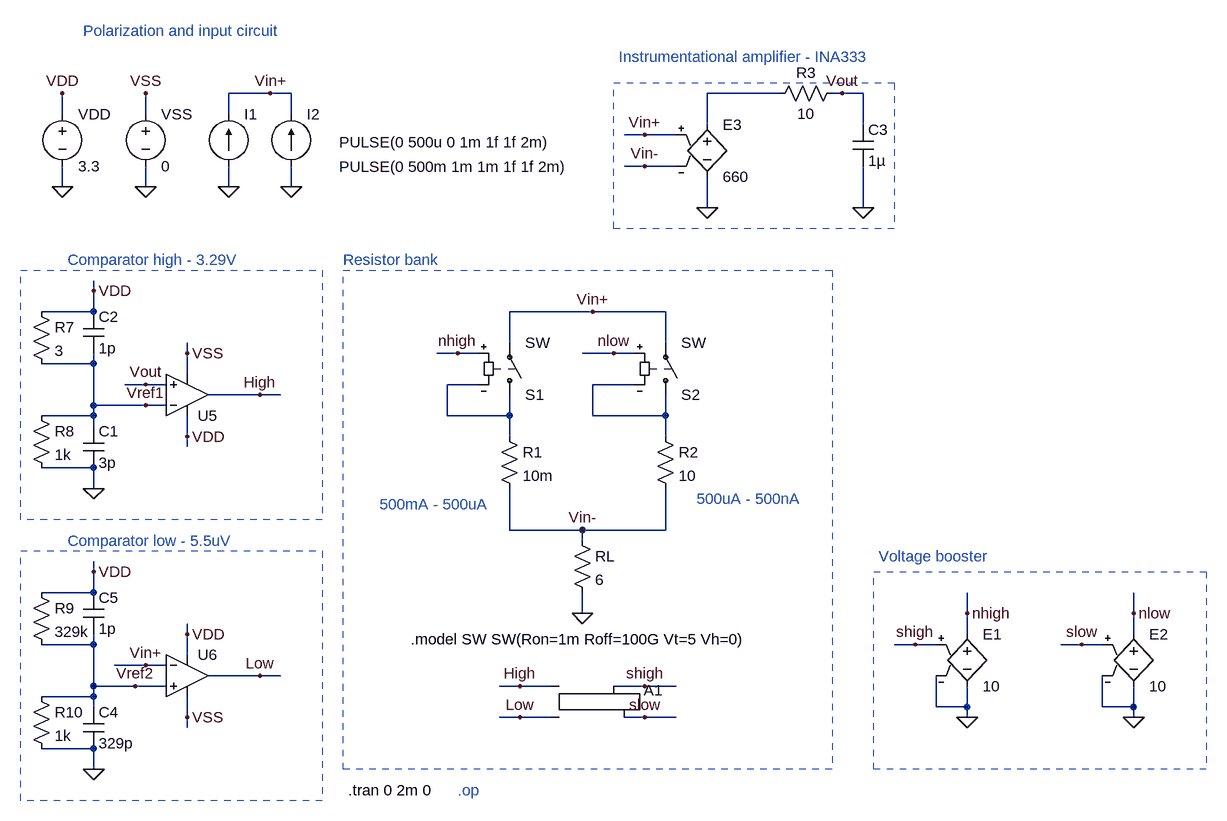
[diagram p0: schematic Top_SCM.asc]
Top_SCM.asc, the LTspice schematic file:
Version 4
SHEET 1 1504 1436
WIRE -832 128 -896 128
WIRE -800 128 -832 128
WIRE -48 128 -160 128
WIRE 48 128 32 128
WIRE 80 128 48 128
WIRE -1152 160 -1152 128
WIRE -1024 160 -1024 128
WIRE -896 160 -896 128
WIRE -800 160 -800 128
WIRE -160 176 -160 128
WIRE 80 176 80 128
WIRE -256 192 -288 192
WIRE -208 192 -256 192
WIRE -256 240 -288 240
WIRE -208 240 -256 240
WIRE -1152 272 -1152 240
WIRE -1024 272 -1024 240
WIRE -896 272 -896 240
WIRE -800 272 -800 240
WIRE -160 304 -160 256
WIRE 80 304 80 240
WIRE -1104 432 -1104 416
WIRE -1104 464 -1104 432
WIRE -1104 464 -1184 464
WIRE -336 464 -464 464
WIRE -224 464 -336 464
WIRE -464 512 -464 464
WIRE -224 512 -224 464
WIRE -960 528 -960 512
WIRE -544 528 -576 528
WIRE -512 528 -544 528
WIRE -304 528 -352 528
WIRE -272 528 -304 528
WIRE -1104 544 -1104 528
WIRE -1104 544 -1184 544
WIRE -960 560 -960 528
WIRE -1024 576 -1056 576
WIRE -992 576 -1024 576
WIRE -512 576 -560 576
WIRE -272 576 -336 576
WIRE -848 592 -928 592
WIRE -816 592 -848 592
WIRE -1104 608 -1104 544
WIRE -1024 608 -1104 608
WIRE -992 608 -1024 608
WIRE -1104 624 -1104 608
WIRE -1104 624 -1184 624
WIRE -560 624 -560 576
WIRE -464 624 -464 592
WIRE -464 624 -560 624
WIRE -336 624 -336 576
WIRE -224 624 -224 592
WIRE -224 624 -336 624
WIRE -1104 640 -1104 624
WIRE -960 656 -960 624
WIRE -464 656 -464 624
WIRE -224 656 -224 624
WIRE -960 672 -960 656
WIRE -1104 704 -1184 704
WIRE -1104 736 -1104 704
WIRE -464 800 -464 736
WIRE -352 800 -464 800
WIRE -224 800 -224 736
WIRE -224 800 -352 800
WIRE -352 816 -352 800
WIRE -1104 864 -1104 848
WIRE -1104 896 -1104 864
WIRE -1104 896 -1184 896
WIRE -352 928 -352 896
WIRE 240 928 240 896
WIRE 496 928 496 896
WIRE -960 960 -960 944
WIRE 240 960 240 928
WIRE 496 960 496 928
WIRE -1104 976 -1104 960
WIRE -1104 976 -1184 976
WIRE 160 976 128 976
WIRE 192 976 160 976
WIRE 416 976 384 976
WIRE 448 976 416 976
WIRE -960 992 -960 960
WIRE -1024 1008 -1072 1008
WIRE -992 1008 -1024 1008
WIRE -848 1024 -928 1024
WIRE -816 1024 -848 1024
WIRE -1104 1040 -1104 976
WIRE -1040 1040 -1104 1040
WIRE -992 1040 -1040 1040
WIRE -448 1040 -480 1040
WIRE -400 1040 -448 1040
WIRE -256 1040 -304 1040
WIRE -208 1040 -256 1040
WIRE -1104 1056 -1104 1040
WIRE -1104 1056 -1184 1056
WIRE -1104 1072 -1104 1056
WIRE 192 1072 192 1024
WIRE 240 1072 240 1040
WIRE 240 1072 192 1072
WIRE 448 1072 448 1024
WIRE 496 1072 496 1040
WIRE 496 1072 448 1072
WIRE -960 1088 -960 1056
WIRE -448 1088 -480 1088
WIRE -400 1088 -448 1088
WIRE -256 1088 -288 1088
WIRE -208 1088 -256 1088
WIRE 240 1088 240 1072
WIRE 496 1088 496 1072
WIRE -960 1104 -960 1088
WIRE -1104 1136 -1184 1136
WIRE -1104 1168 -1104 1136
FLAG -896 272 0
FLAG -832 128 Vin+
FLAG -1152 272 0
FLAG -1024 272 0
FLAG -1024 128 VSS
FLAG -1152 128 VDD
FLAG -960 528 VSS
FLAG -960 656 VDD
FLAG -1104 736 0
FLAG -1104 432 VDD
FLAG -848 592 High
FLAG -960 1088 VSS
FLAG -960 960 VDD
FLAG -1104 1168 0
FLAG -1104 864 VDD
FLAG -848 1024 Low
FLAG -800 272 0
FLAG -352 928 0
FLAG -352 800 Vin-
FLAG -336 464 Vin+
FLAG -448 1088 Low
FLAG -448 1040 High
FLAG -256 1040 shigh
FLAG -256 1088 slow
FLAG -544 528 nhigh
FLAG -304 528 nlow
FLAG 240 1088 0
FLAG 160 976 shigh
FLAG 240 928 nhigh
FLAG 496 1088 0
FLAG 416 976 slow
FLAG 496 928 nlow
FLAG -1024 576 Vout
FLAG -1024 608 Vref1
FLAG -1040 1040 Vref2
FLAG -1024 1008 Vin+
FLAG -160 304 0
FLAG -256 192 Vin+
FLAG -256 240 Vin-
FLAG 80 304 0
FLAG 48 128 Vout
SYMBOL current -896 240 M180
WINDOW 0 24 80 Left 2
WINDOW 3 170 37 Left 2
WINDOW 123 0 0 Left 0
WINDOW 39 0 0 Left 0
SYMATTR InstName I1
SYMATTR Value PULSE(0 500u 0 1m 1f 1f 2m)
SYMBOL voltage -1152 144 R0
WINDOW 123 0 0 Left 0
WINDOW 39 0 0 Left 0
SYMATTR InstName VDD
SYMATTR Value 3.3
SYMBOL voltage -1024 144 R0
WINDOW 123 0 0 Left 0
WINDOW 39 0 0 Left 0
SYMATTR InstName VSS
SYMATTR Value 0
SYMBOL res -480 640 R0
SYMATTR InstName R1
SYMATTR Value 10m
SYMBOL res -240 640 R0
SYMATTR InstName R2
SYMATTR Value 10
SYMBOL OpAmps\\UniversalOpAmp2 -960 592 M180
SYMATTR InstName U5
SYMBOL cap -1120 640 R0
SYMATTR InstName C1
SYMATTR Value 3p
SYMBOL cap -1120 464 R0
SYMATTR InstName C2
SYMATTR Value 1p
SYMBOL res -1200 448 R0
SYMATTR InstName R7
SYMATTR Value 3
SYMBOL res -1200 608 R0
SYMATTR InstName R8
SYMATTR Value 1k
SYMBOL OpAmps\\UniversalOpAmp2 -960 1024 R0
SYMATTR InstName U6
SYMBOL cap -1120 1072 R0
SYMATTR InstName C4
SYMATTR Value 329p
SYMBOL cap -1120 896 R0
SYMATTR InstName C5
SYMATTR Value 1p
SYMBOL res -1200 880 R0
SYMATTR InstName R9
SYMATTR Value 329k
SYMBOL res -1200 1040 R0
SYMATTR InstName R10
SYMATTR Value 1k
SYMBOL current -800 240 M180
WINDOW 0 24 80 Left 2
WINDOW 3 74 -1 Left 2
WINDOW 123 0 0 Left 0
WINDOW 39 0 0 Left 0
SYMATTR InstName I2
SYMATTR Value PULSE(0 500m 1m 1m 1f 1f 2m)
SYMBOL Digital\\srflop -352 992 R0
SYMATTR InstName A1
SYMBOL res -368 800 R0
SYMATTR InstName RL
SYMATTR Value 6
SYMBOL e 240 944 R0
SYMATTR InstName E1
SYMATTR Value 10
SYMBOL e 496 944 R0
SYMATTR InstName E2
SYMATTR Value 10
SYMBOL sw -464 608 M180
SYMATTR InstName S1
SYMBOL sw -224 608 M180
SYMATTR InstName S2
SYMBOL e -160 160 R0
SYMATTR InstName E3
SYMATTR Value 660
SYMBOL res 48 112 R90
WINDOW 0 0 56 VBottom 2
WINDOW 3 32 56 VTop 2
SYMATTR InstName R3
SYMATTR Value 10
SYMBOL cap 64 176 R0
SYMATTR InstName C3
SYMATTR Value 1µ
TEXT -296 72 Left 2 ;Instrumentational amplifier - INA333
TEXT -1120 32 Left 2 ;Polarization and input circuit
TEXT -720 384 Left 2 ;Resistor bank
TEXT -544 1200 Left 2 ;.op
TEXT -712 1200 Left 2 !.tran 0 2m 0
TEXT -1144 384 Left 2 ;Comparator high - 3.29V
TEXT -1144 816 Left 2 ;Comparator low - 5.5uV
TEXT -176 752 Left 2 ;500uA - 500nA
TEXT -664 760 Left 2 ;500mA - 500uA
TEXT -616 968 Left 2 !.model SW SW(Ron=1m Roff=100G Vt=5 Vh=0)
TEXT 104 840 Left 2 ;Voltage booster
RECTANGLE Normal -752 784 -1216 400 2
RECTANGLE Normal -752 1216 -1216 832 2
RECTANGLE Normal 128 336 -304 112 2
RECTANGLE Normal 32 1168 -720 400 2
RECTANGLE Normal 608 1168 96 864 2

The netlist it stands for:
* Top_SCM.asc
I1 0 Vin+ PULSE(0 500u 0 1m 1f 1f 2m)
VDD VDD 0 3.3
VSS VSS 0 0
R1 N002 Vin- 10m
R2 N003 Vin- 10
XU5 Vout Vref1 VDD VSS High level2 Avol=1Meg GBW=10Meg Slew=10Meg Ilimit=25m Rail=0 Vos=0 En=0 Enk=0 In=0 Ink=0 Rin=500Meg  ; pins In+ In- V+ V- OUT
C1 Vref1 0 3p
C2 VDD Vref1 1p
R7 VDD Vref1 3
R8 Vref1 0 1k
XU6 Vref2 Vin+ VDD VSS Low level2 Avol=1Meg GBW=10Meg Slew=10Meg Ilimit=25m Rail=0 Vos=0 En=0 Enk=0 In=0 Ink=0 Rin=500Meg  ; pins In+ In- V+ V- OUT
C4 Vref2 0 329p
C5 VDD Vref2 1p
R9 VDD Vref2 329k
R10 Vref2 0 1k
I2 0 Vin+ PULSE(0 500m 1m 1m 1f 1f 2m)
A1 High Low 0 0 0 slow shigh 0 SRFLOP
RL Vin- 0 6
E1 nhigh 0 shigh 0 10
E2 nlow 0 slow 0 10
S1 N002 Vin+ nhigh N002 SW
S2 N003 Vin+ nlow N003 SW
E3 N001 0 Vin+ Vin- 660
R3 Vout N001 10
C3 Vout 0 1µ
* Instrumentational amplifier - INA333
* Polarization and input circuit
* Resistor bank
* .op
.tran 0 2m 0
* Comparator high - 3.29V
* Comparator low - 5.5uV
* 500uA - 500nA
* 500mA - 500uA
.model SW SW(Ron=1m Roff=100G Vt=5 Vh=0)
* Voltage booster
.lib UniversalOpAmp2.lib
.backanno
.end